# EAGLE design ADSR 7555 CTRL (EAGLE 7.7.0)
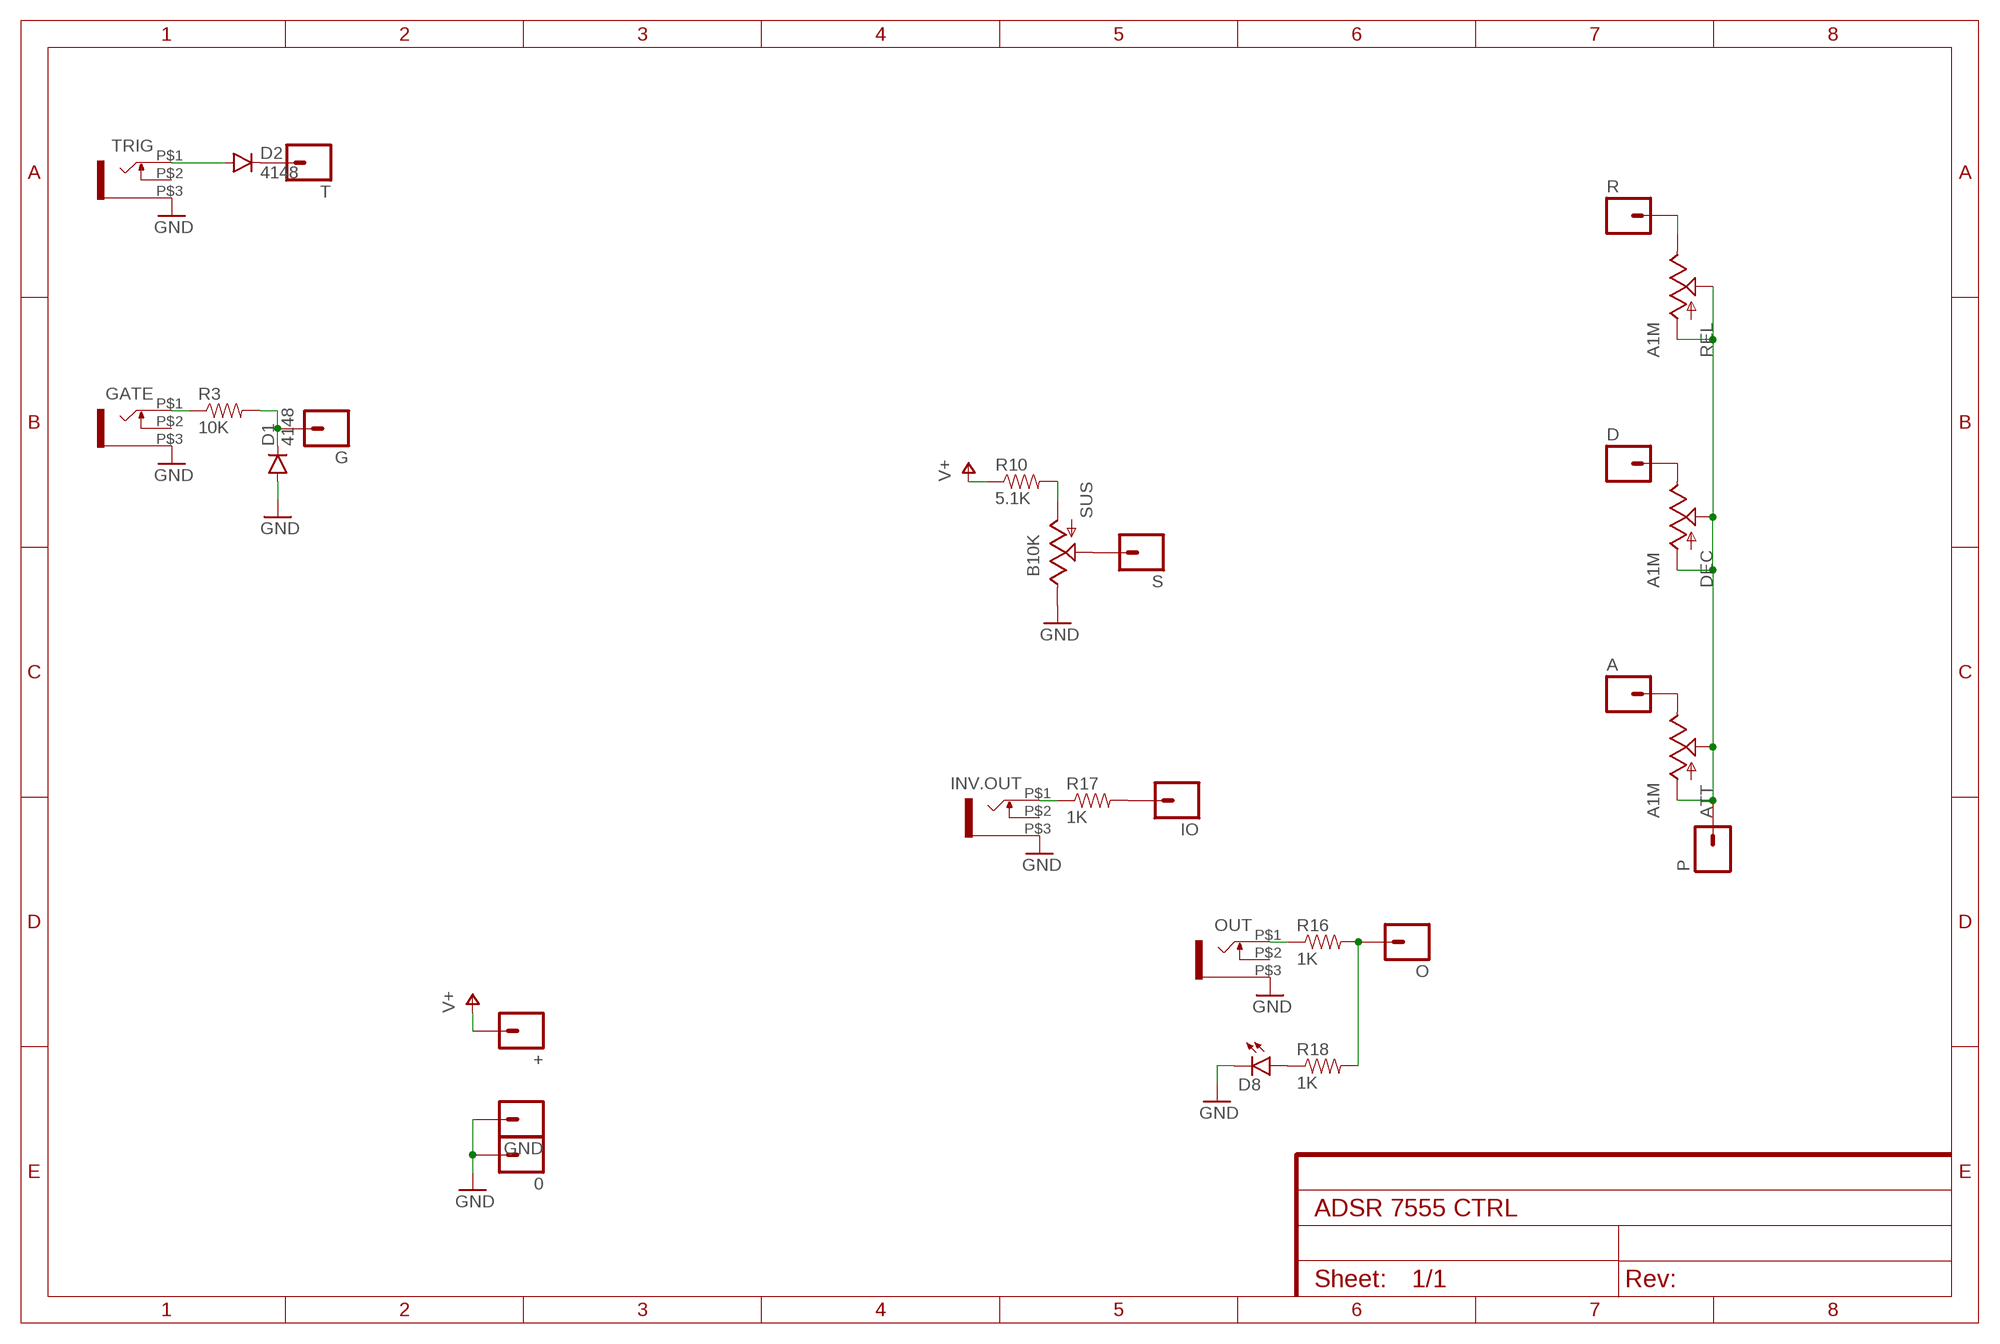
[diagram p0: schematic, sheet 1]

## Parts
0  M01PTH  [1X01]
+  M01PTH  [1X01]
A  M01PTH  [1X01]
ATT  A1M  POT  [ALPS_POT]
D  M01PTH  [1X01]
D1  4148  DIODESOD123  [SOD-123]
D2  4148  DIODESOD123  [SOD-123]
D8  LED3MM  [LED3MM]
DEC  A1M  POT  [ALPS_POT]
G  M01PTH  [1X01]
GATE  WQP-PJ301M-12_JACK  [WQP-PJ301M-12_JACK]
GND  M01PTH  [1X01]
INV.OUT  WQP-PJ301M-12_JACK  [WQP-PJ301M-12_JACK]
IO  M01PTH  [1X01]
O  M01PTH  [1X01]
OUT  WQP-PJ301M-12_JACK  [WQP-PJ301M-12_JACK]
P  M01PTH  [1X01]
R  M01PTH  [1X01]
R3  10K  RESISTOR0805-RES  [0805@1]
R10  5.1K  RESISTOR0805-RES  [0805@1]
R16  1K  RESISTOR0805-RES  [0805@1]
R17  1K  RESISTOR0805-RES  [0805@1]
R18  1K  RESISTOR0805-RES  [0805@1]
REL  A1M  POT  [ALPS_POT]
S  M01PTH  [1X01]
SUS  B10K  POT  [ALPS_POT]
T  M01PTH  [1X01]
TRIG  WQP-PJ301M-12_JACK  [WQP-PJ301M-12_JACK]

## Nets
GND: 0.1 D1.A D8.K(C) GATE.P$3 GND.1 INV.OUT.P$3 OUT.P$3 SUS.P$1(E) TRIG.P$3
N$1: D2.C T.1
N$2: S.1 SUS.P$2(S)
N$3: IO.1 R17.2
N$4: GATE.P$1 R3.1
N$5: D1.C G.1 R3.2
N$6: O.1 R16.2 R18.2
N$7: A.1 ATT.P$1(E)
N$8: D.1 DEC.P$1(E)
N$9: D8.A R18.1
N$12: D2.A TRIG.P$1
N$13: R10.2 SUS.P$3(A)
N$22: R.1 REL.P$1(E)
N$24: ATT.P$2(S) ATT.P$3(A) DEC.P$2(S) DEC.P$3(A) P.1 REL.P$2(S) REL.P$3(A)
N$27: INV.OUT.P$1 R17.1
N$31: OUT.P$1 R16.1
V+: +.1 R10.1
Unconnected: GATE.P$2 INV.OUT.P$2 OUT.P$2 TRIG.P$2

## Library data of the parts
0 + A D G GND IO O P R S T = SparkFun-Connectors:M01: Header 1 Standard 1-pin 0.1" header. Use with straight break away headers (SKU : PRT-00116), right angle break away headers (PRT-00553), swiss pins (PRT-00743), machine pins (PRT-00117), and female headers (PRT-00115).
ATT DEC REL SUS = SparkFun-Electromechanical:POT; PROD_ID: RES-09177
D1 D2 = SparkFun-DiscreteSemi:DIODE: Diode These are standard reverse protection diodes and small signal diodes. SMA package can handle up to about 1A. SOD-323 can handle about 200mA. What the SOD-323 package when ordering, there are some mfgs out there that are 5-pin packages.
D8 = SparkFun-LED:LED: LEDs Standard schematic elements and footprints for 5mm, 3mm, 1206, and 0603 sized LEDs. 5mm - Spark Fun Electronics SKU : COM-00529 (and others)
GATE INV.OUT OUT TRIG = thonkiconn:WQP-PJ301M-12_JACK
R3 R10 R16-R18 = SparkFun-Passives:RESISTOR: Resistor Basic schematic elements and footprints for 0603, 1206, and PTH resistors.

## Board
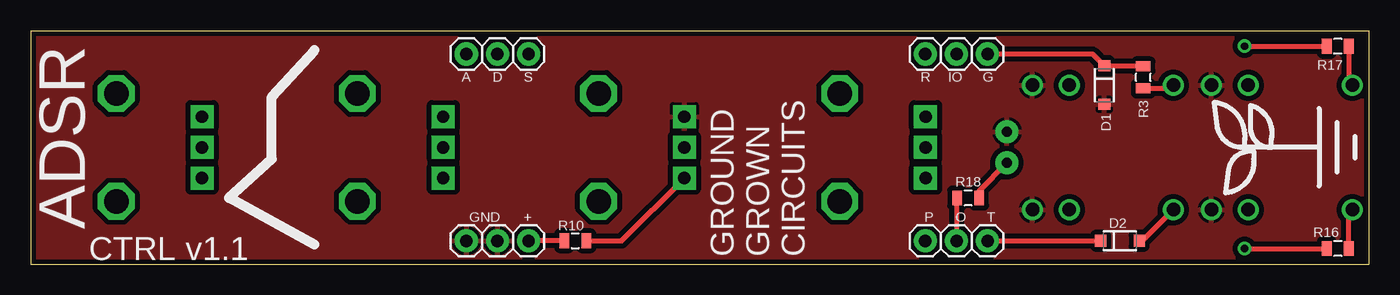
[diagram p1: board, top side]
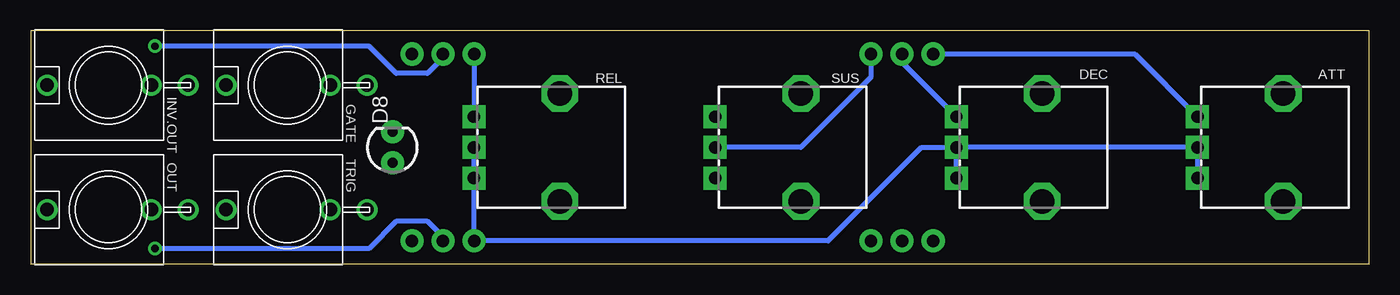
[diagram p2: board, bottom side, seen from below]

Size 109.22 x 19.05 mm. Coordinates in mm from the lower left corner, seen from the top.
Outline: 0,0 109.22,0 109.22,19.05 0,19.05 0,0
Copper layers (1*16): Top 0.035mm / dielectric 1.5mm / Bottom 0.035mm
Design rules "SparkFun": minimum track width 8mil, minimum drill 20mil, track to track 8mil, track to pad 8mil, pad to pad 8mil, via to via 8mil, smd to smd 8mil, copper to edge 8mil, drill to drill 8mil, minimum pad ring 12mil, minimum via ring 10mil, stop-mask expansion 4mil, vias tented up to drill 20mil, thermal gap 10mil

### Footprints (pad centres in the part's own frame; a part is rotated, then mirrored left to right if it is on the bottom)
1X01 = drill 1.016 pad 1.88: 1 0,0
ALPS_POT = drill 1 pad 1.88 square: P$1 7,-2.5; P$2 7,0; P$3 7,2.5 | drill 2 octagon: P$4 0,-4.4; P$5 0,4.4
SOD-123 = smd 0.9 x 0.95: A 1.575,0; C -1.575,0
LED3MM = drill 0.813 pad 1.88: A -1.27,0; K 1.27,0
WQP-PJ301M-12_JACK = drill 1.1: P$1 0,5; P$2 0,-3.5; P$3 0,-6.5
0805@1 = smd 0.8 x 1.2: 1 -0.9,0; 2 0.9,0

### Placement (x,y rotation side)
0  38.1,1.91 0 top
+  40.64,1.91 0 top
A  35.56,17.14 0 top
ATT  6.99,9.53 180 bottom
D  38.1,17.14 0 top
D1  87.63,14.61 270 top
D2  88.9,1.91 0 top
D8  79.69,9.53 90 bottom
DEC  26.67,9.53 180 bottom
G  78.11,17.14 0 top
GATE  88.27,14.61 90 bottom
GND  35.56,1.91 0 top
INV.OUT  102.87,14.61 90 bottom
IO  75.56,17.14 0 top
O  75.56,1.91 0 top
OUT  102.87,4.45 90 bottom
P  73.03,1.91 0 top
R  73.03,17.14 0 top
R3  90.81,15.24 90 top
R10  44.45,1.91 0 top
R16  106.68,1.27 180 top
R17  106.68,17.78 180 top
R18  76.52,5.4 180 top
REL  66.04,9.53 180 bottom
S  40.64,17.14 0 top
SUS  46.35,9.53 180 bottom
T  78.11,1.91 0 top
TRIG  88.27,4.45 90 bottom
U$1  [LOGO_MED]  105.09,9.53 90 top

### Tracks (layer width: path | path; a pad name or v marks a point on that pad's centre or on a via)
GND
  pour Top (isolate 0.406): 0,0 109.22,0 109.22,19.05 0,19.05
N$1
  Top 0.406: T.1 D2.C
N$2
  Bottom 0.406: S.1 40.64,15.24 46.35,9.53 SUS.P$2
N$3  (via drill 0.6)
  Top 0.406: v99.06,17.78 R17.2
  Bottom 0.406: IO.1 75.56,16.83 76.83,15.56 79.38,15.56 81.6,17.78 v99.06,17.78
N$4
  Top 0.406: R3.1 93,14.34 GATE.P$1
N$5
  Top 0.406: G.1 86.67,17.14 D1.C 90.77,16.18 R3.2
N$6  (via drill 0.6)
  Top 0.406: v99.06,1.27 R16.2 | O.1 75.62,1.91 R18.2
  Bottom 0.406: O.1 75.56,2.22 76.83,3.49 79.38,3.49 81.6,1.27 v99.06,1.27
N$7
  Bottom 0.406: A.1 19.11,17.14 ATT.P$1
N$8
  Bottom 0.406: D.1 38.1,16.45 DEC.P$1
N$9
  Top 0.406: R18.1 77.42,5.98 D8.A
N$12
  Top 0.406: D2.A 90.72,1.91 TRIG.P$1
N$13
  Top 0.406: R10.2 48.23,1.91 SUS.P$3
N$22
  Bottom 0.406: R.1 73.03,12.04 REL.P$1
N$24
  Bottom 0.406: ATT.P$3 ATT.P$2 DEC.P$2 | DEC.P$3 DEC.P$2 | DEC.P$2 36.51,9.53 44.13,1.91 P.1 73.03,7.01 REL.P$3 REL.P$2
N$27
  Top 0.406: R17.1 107.58,14.89 INV.OUT.P$1
N$31
  Top 0.406: R16.1 107.58,4.16 OUT.P$1
V+
  Top 0.406: R10.1 +.1

### Text on the board
tPlace: ADSR | GROUND / GROWN / CIRCUITS | CTRL v1.1